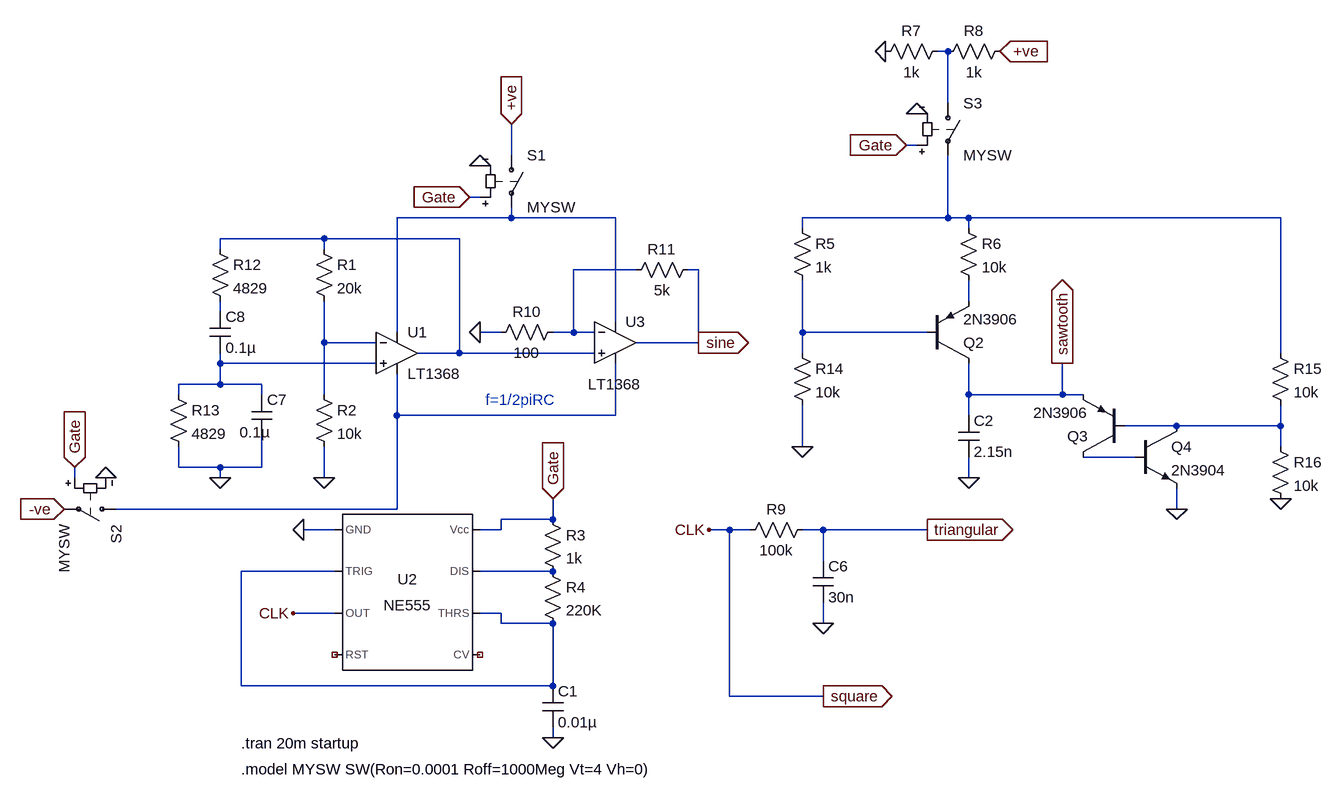
[diagram p0: schematic mi.asc]
mi.asc, the LTspice schematic file:
Version 4
SHEET 1 2564 792
WIRE 1392 -416 1376 -416
WIRE 1392 -336 1392 -416
WIRE 1344 -272 1328 -272
WIRE 720 -256 720 -304
WIRE 672 -192 656 -192
WIRE 720 -160 720 -176
WIRE 720 -160 544 -160
WIRE 880 -160 720 -160
WIRE 1392 -160 1392 -256
WIRE 1392 -160 1168 -160
WIRE 1424 -160 1392 -160
WIRE 1904 -160 1424 -160
WIRE 1168 -144 1168 -160
WIRE 1424 -144 1424 -160
WIRE 432 -128 272 -128
WIRE 640 -128 432 -128
WIRE 272 -112 272 -128
WIRE 432 -112 432 -128
WIRE 912 -80 816 -80
WIRE 1008 -80 992 -80
WIRE 1424 -32 1424 -64
WIRE 272 -16 272 -32
WIRE 880 0 880 -160
WIRE 544 16 544 -160
WIRE 704 16 672 16
WIRE 816 16 816 -80
WIRE 816 16 784 16
WIRE 848 16 816 16
WIRE 1168 16 1168 -64
WIRE 1360 16 1168 16
WIRE 432 32 432 -32
WIRE 512 32 432 32
WIRE 1008 32 1008 -80
WIRE 1008 32 912 32
WIRE 640 48 640 -128
WIRE 640 48 576 48
WIRE 848 48 640 48
WIRE 1168 48 1168 16
WIRE 1904 48 1904 -160
WIRE 272 64 272 48
WIRE 512 64 272 64
WIRE 272 96 272 64
WIRE 272 96 208 96
WIRE 336 96 272 96
WIRE 208 112 208 96
WIRE 336 112 336 96
WIRE 432 112 432 32
WIRE 1424 112 1424 64
WIRE 1568 112 1568 64
WIRE 1568 112 1424 112
WIRE 1600 112 1568 112
WIRE 544 144 544 80
WIRE 880 144 880 64
WIRE 880 144 544 144
WIRE 1424 144 1424 112
WIRE 1744 160 1664 160
WIRE 1904 160 1904 128
WIRE 1904 160 1744 160
WIRE 1168 192 1168 128
WIRE 1904 192 1904 160
WIRE 1680 208 1600 208
WIRE 208 224 208 192
WIRE 272 224 208 224
WIRE 336 224 336 176
WIRE 336 224 272 224
WIRE 48 240 48 224
WIRE 272 240 272 224
WIRE 432 240 432 192
WIRE 1424 240 1424 208
WIRE 544 288 544 144
WIRE 544 288 112 288
WIRE 1744 288 1744 256
WIRE 784 304 784 272
WIRE 784 304 704 304
WIRE 448 320 400 320
WIRE 704 320 704 304
WIRE 704 320 672 320
WIRE 1056 320 1024 320
WIRE 1088 320 1056 320
WIRE 1200 320 1168 320
WIRE 1360 320 1200 320
WIRE 1200 368 1200 320
WIRE 448 384 304 384
WIRE 784 384 672 384
WIRE 448 448 384 448
WIRE 704 448 672 448
WIRE 704 464 704 448
WIRE 784 464 704 464
WIRE 1200 464 1200 432
WIRE 304 560 304 384
WIRE 784 560 784 464
WIRE 784 560 304 560
WIRE 1056 576 1056 320
WIRE 1200 576 1056 576
WIRE 784 640 784 624
FLAG 432 240 0
FLAG 1008 32 sine
IOPIN 1008 32 Out
FLAG 384 448 CLK
FLAG 400 320 0
FLAG 1024 320 CLK
FLAG 1200 464 0
FLAG 1200 576 square
IOPIN 1200 576 Out
FLAG 1360 320 triangular
IOPIN 1360 320 Out
FLAG 672 16 0
FLAG 272 240 0
FLAG 784 640 0
FLAG 784 272 Gate
IOPIN 784 272 In
FLAG 1424 240 0
FLAG 1168 192 0
FLAG 1744 288 0
FLAG 1904 272 0
FLAG 1568 64 sawtooth
IOPIN 1568 64 Out
FLAG 720 -304 +ve
IOPIN 720 -304 In
FLAG 672 -240 0
FLAG 656 -192 Gate
IOPIN 656 -192 In
FLAG 32 288 -ve
IOPIN 32 288 In
FLAG 96 240 0
FLAG 48 224 Gate
IOPIN 48 224 In
FLAG 1472 -416 +ve
IOPIN 1472 -416 In
FLAG 1296 -416 0
FLAG 1344 -320 0
FLAG 1328 -272 Gate
IOPIN 1328 -272 In
SYMBOL res 416 -128 R0
SYMATTR InstName R1
SYMATTR Value 20k
SYMBOL res 416 96 R0
SYMATTR InstName R2
SYMATTR Value 10k
SYMBOL Opamps\\LT1368 544 -16 R0
SYMATTR InstName U1
SYMBOL Misc\\NE555 560 416 R0
SYMATTR InstName U2
SYMBOL res 1184 304 R90
WINDOW 0 0 56 VBottom 2
WINDOW 3 32 56 VTop 2
SYMATTR InstName R9
SYMATTR Value 100k
SYMBOL cap 1184 368 R0
SYMATTR InstName C6
SYMATTR Value 30n
SYMBOL Opamps\\LT1368 880 -32 R0
WINDOW 3 -42 128 Left 2
SYMATTR InstName U3
SYMBOL res 800 0 R90
WINDOW 0 0 56 VBottom 2
WINDOW 3 32 56 VTop 2
SYMATTR InstName R10
SYMATTR Value 100
SYMBOL res 1008 -96 R90
WINDOW 0 0 56 VBottom 2
WINDOW 3 32 56 VTop 2
SYMATTR InstName R11
SYMATTR Value 5k
SYMBOL cap 320 112 R0
WINDOW 3 -18 58 Left 2
SYMATTR Value 0.1µ
SYMATTR InstName C7
SYMBOL cap 256 -16 R0
SYMATTR InstName C8
SYMATTR Value 0.1µ
SYMBOL res 256 -128 R0
SYMATTR InstName R12
SYMATTR Value 4829
SYMBOL res 192 96 R0
SYMATTR InstName R13
SYMATTR Value 4829
SYMBOL res 768 288 R0
SYMATTR InstName R3
SYMATTR Value 1k
SYMBOL res 768 368 R0
SYMATTR InstName R4
SYMATTR Value 220K
SYMBOL cap 768 560 R0
SYMATTR InstName C1
SYMATTR Value 0.01µ
SYMBOL res 1152 -160 R0
SYMATTR InstName R5
SYMATTR Value 1k
SYMBOL res 1408 -160 R0
SYMATTR InstName R6
SYMATTR Value 10k
SYMBOL pnp 1360 64 M180
SYMATTR InstName Q2
SYMATTR Value 2N3906
SYMBOL res 1152 32 R0
SYMATTR InstName R14
SYMATTR Value 10k
SYMBOL pnp 1664 208 R180
SYMATTR InstName Q3
SYMATTR Value 2N3906
SYMBOL cap 1408 144 R0
SYMATTR InstName C2
SYMATTR Value 2.15n
SYMBOL npn 1680 160 R0
SYMATTR InstName Q4
SYMATTR Value 2N3904
SYMBOL res 1888 32 R0
SYMATTR InstName R15
SYMATTR Value 10k
SYMBOL res 1888 176 R0
SYMATTR InstName R16
SYMATTR Value 10k
SYMBOL sw 720 -272 R0
SYMATTR InstName S1
SYMATTR Value MYSW
SYMBOL sw 128 288 R90
SYMATTR InstName S2
SYMATTR Value MYSW
SYMBOL res 1392 -432 R90
WINDOW 0 0 56 VBottom 2
WINDOW 3 32 56 VTop 2
SYMATTR InstName R7
SYMATTR Value 1k
SYMBOL res 1488 -432 R90
WINDOW 0 0 56 VBottom 2
WINDOW 3 32 56 VTop 2
SYMATTR InstName R8
SYMATTR Value 1k
SYMBOL sw 1392 -352 R0
SYMATTR InstName S3
SYMATTR Value MYSW
TEXT 680 120 Left 2 ;f=1/2piRC
TEXT 304 648 Left 2 !.tran 20m startup
TEXT 304 688 Left 2 !.model MYSW SW(Ron=0.0001 Roff=1000Meg Vt=4 Vh=0)

The netlist it stands for:
* mi.asc
R1 N004 N009 20k
R2 N009 0 10k
XU1 N010 N009 N002 N011 N004 LT1368  ; pins In+ In- V+ V- OUT
XU2 0 N014 square NC_01 NC_02 N014 N015 Gate NE555  ; pins GND TRIG OUT RST CV THRS DIS Vcc
R9 triangular square 100k
C6 triangular 0 30n
XU3 N004 N005 N002 N011 sine LT1368  ; pins In+ In- V+ V- OUT
R10 N005 0 100
R11 sine N005 5k
C7 N010 0 0.1µ
C8 N007 N010 0.1µ
R12 N004 N007 4829
R13 N010 0 4829
R3 Gate N015 1k
R4 N015 N014 220K
C1 N014 0 0.01µ
R5 N003 N008 1k
R6 N003 N006 10k
Q2 sawtooth N008 N006 0 2N3906
R14 N008 0 10k
Q3 N013 N012 sawtooth 0 2N3906
C2 sawtooth 0 2.15n
Q4 N012 N013 0 0 2N3904
R15 N003 N012 10k
R16 N012 0 10k
S1 +ve N002 Gate 0 MYSW
S2 N011 -ve Gate 0 MYSW
R7 N001 0 1k
R8 +ve N001 1k
S3 N001 N003 Gate 0 MYSW
.model NPN NPN
.model PNP PNP
.lib standard.bjt
* f=1/2piRC
.tran 20m startup
.model MYSW SW(Ron=0.0001 Roff=1000Meg Vt=4 Vh=0)
.lib NE555.sub
.backanno
.end